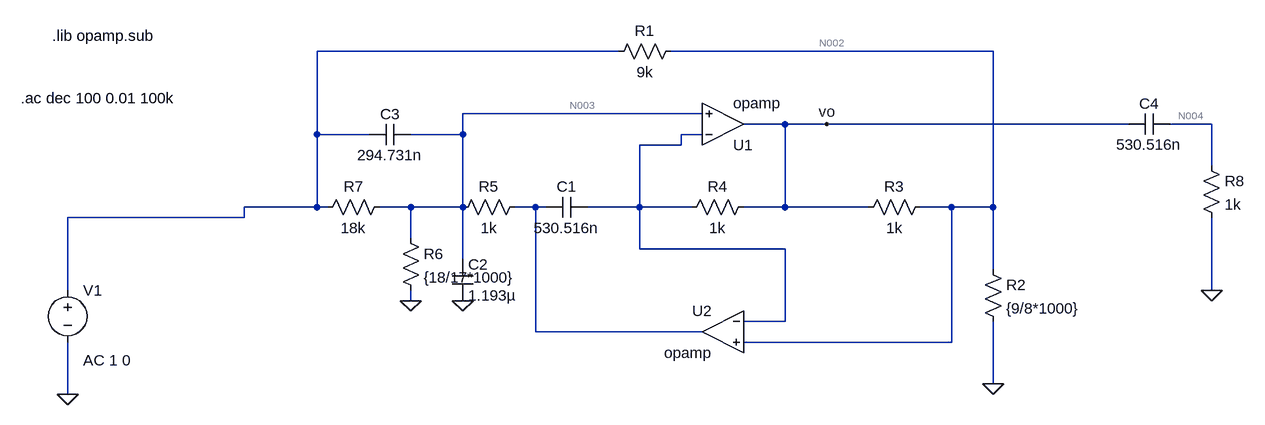
[diagram p0: schematic Circ2.asc]
Circ2.asc, the LTspice schematic file:
Version 4
SHEET 1 1240 680
WIRE 272 -64 -192 -64
WIRE 848 -64 352 -64
WIRE 400 32 32 32
WIRE 528 48 464 48
WIRE 592 48 528 48
WIRE 1056 48 592 48
WIRE 1184 48 1120 48
WIRE -192 64 -192 -64
WIRE -112 64 -192 64
WIRE 32 64 32 32
WIRE 32 64 -48 64
WIRE 400 64 368 64
WIRE 368 80 368 64
WIRE 368 80 304 80
WIRE 1184 112 1184 48
WIRE -192 176 -192 64
WIRE -192 176 -304 176
WIRE -176 176 -192 176
WIRE -48 176 -96 176
WIRE 32 176 32 64
WIRE 32 176 -48 176
WIRE 144 176 112 176
WIRE 160 176 144 176
WIRE 304 176 304 80
WIRE 304 176 224 176
WIRE 384 176 304 176
WIRE 528 176 528 48
WIRE 528 176 464 176
WIRE 656 176 528 176
WIRE 784 176 736 176
WIRE 848 176 848 -64
WIRE 848 176 784 176
WIRE -304 192 -304 176
WIRE -304 192 -576 192
WIRE -48 224 -48 176
WIRE 304 240 304 176
WIRE 528 240 304 240
WIRE 32 256 32 176
WIRE 848 272 848 176
WIRE -576 304 -576 192
WIRE 1184 304 1184 192
WIRE -48 320 -48 304
WIRE 528 352 528 240
WIRE 528 352 464 352
WIRE 144 368 144 176
WIRE 400 368 144 368
WIRE 784 384 784 176
WIRE 784 384 464 384
WIRE 848 448 848 352
WIRE -576 464 -576 384
FLAG 848 448 0
FLAG 32 320 0
FLAG -48 320 0
FLAG 592 48 vo
FLAG 1184 304 0
FLAG -576 464 0
SYMBOL res 368 -80 R90
WINDOW 0 0 56 VBottom 2
WINDOW 3 32 56 VTop 2
SYMATTR InstName R1
SYMATTR Value 9k
SYMBOL res 832 256 R0
SYMATTR InstName R2
SYMATTR Value {9/8*1000}
SYMBOL res 752 160 R90
WINDOW 0 0 56 VBottom 2
WINDOW 3 32 56 VTop 2
SYMATTR InstName R3
SYMATTR Value 1k
SYMBOL res 480 160 R90
WINDOW 0 0 56 VBottom 2
WINDOW 3 32 56 VTop 2
SYMATTR InstName R4
SYMATTR Value 1k
SYMBOL cap 224 160 R90
WINDOW 0 0 32 VBottom 2
WINDOW 3 32 32 VTop 2
SYMATTR InstName C1
SYMATTR Value 530.516n
SYMBOL res 128 160 R90
WINDOW 0 0 56 VBottom 2
WINDOW 3 32 56 VTop 2
SYMATTR InstName R5
SYMATTR Value 1k
SYMBOL cap 16 256 R0
SYMATTR InstName C2
SYMATTR Value 1.193µ
SYMBOL res -64 208 R0
SYMATTR InstName R6
SYMATTR Value {18/17*1000}
SYMBOL res -80 160 R90
WINDOW 0 0 56 VBottom 2
WINDOW 3 32 56 VTop 2
SYMATTR InstName R7
SYMATTR Value 18k
SYMBOL cap -48 48 R90
WINDOW 0 0 32 VBottom 2
WINDOW 3 32 32 VTop 2
SYMATTR InstName C3
SYMATTR Value 294.731n
SYMBOL OpAmps\\opamp 432 112 M180
SYMATTR InstName U1
SYMBOL OpAmps\\opamp 432 304 M0
SYMATTR InstName U2
SYMBOL res 1168 96 R0
SYMATTR InstName R8
SYMATTR Value 1k
SYMBOL cap 1120 32 R90
WINDOW 0 0 32 VBottom 2
WINDOW 3 32 32 VTop 2
SYMATTR InstName C4
SYMATTR Value 530.516n
SYMBOL voltage -576 288 R0
WINDOW 123 24 124 Left 2
WINDOW 39 0 0 Left 0
SYMATTR Value2 AC 1 0
SYMATTR InstName V1
SYMATTR Value ""
TEXT -600 -88 Left 2 !.lib opamp.sub
TEXT -648 8 Left 2 !.ac dec 100 0.01 100k

The netlist it stands for:
* Circ2.asc
R1 N002 N001 9k
R2 N002 0 {9/8*1000}
R3 N002 vo 1k
R4 vo N005 1k
C1 N005 N006 530.516n
R5 N006 N003 1k
C2 N003 0 1.193µ
R6 N003 0 {18/17*1000}
R7 N003 N001 18k
C3 N003 N001 294.731n
XU1 N005 N003 vo opamp Aol=100K GBW=10Meg  ; pins invin noninvin out
XU2 N005 N002 N006 opamp Aol=100K GBW=10Meg  ; pins invin noninvin out
R8 N004 0 1k
C4 N004 vo 530.516n
V1 N001 0 AC 1 0
.lib opamp.sub
.ac dec 100 0.01 100k
.backanno
.end

* Results of the author's LTspice run, read from the files saved beside the schematic
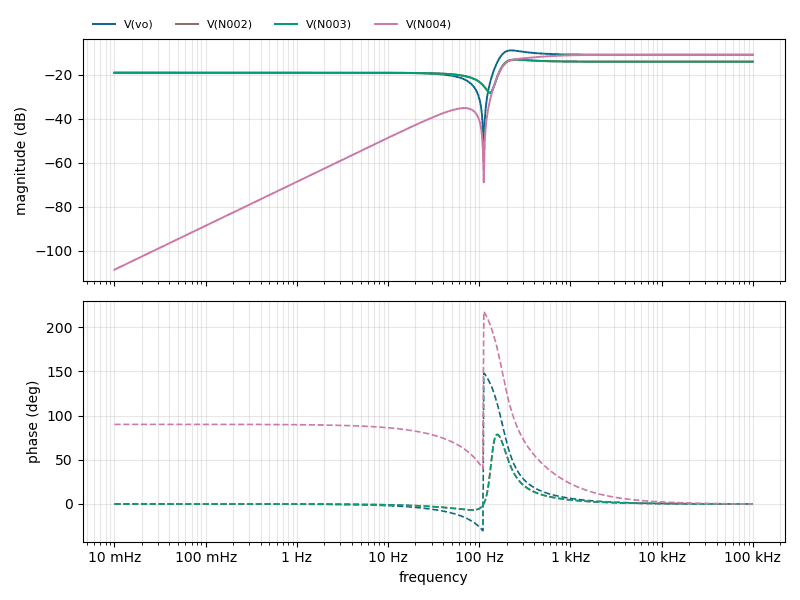
[diagram p1: AC Analysis of Circ2.asc, plotted from the saved traces]
* AC Analysis, 1 run:
*   V(vo): -19.09 dB at 10 mHz, -10.90 dB at 100 kHz, peak -8.93 dB at 223.9 Hz, 3 dB below the peak at 170 Hz
*   V(N002): -19.08 dB at 10 mHz, -14.06 dB at 100 kHz, peak -13.12 dB at 251.2 Hz, 3 dB below the peak at 179.3 Hz
*   V(N003): -19.09 dB at 10 mHz, -14.06 dB at 100 kHz, peak -13.12 dB at 251.2 Hz, 3 dB below the peak at 179.3 Hz
*   V(N004): -108.63 dB at 10 mHz, -10.90 dB at 100 kHz, peak -10.90 dB at 100 kHz, 3 dB below the peak at 208.9 Hz